# EasyEDA schematic SCH_Senior_Transmitter_2026-03-29.json
TITLE: Sheet_1; REV: 1.0; Date: 2025-12-26; Sheet: 1/1; Company: Your Company
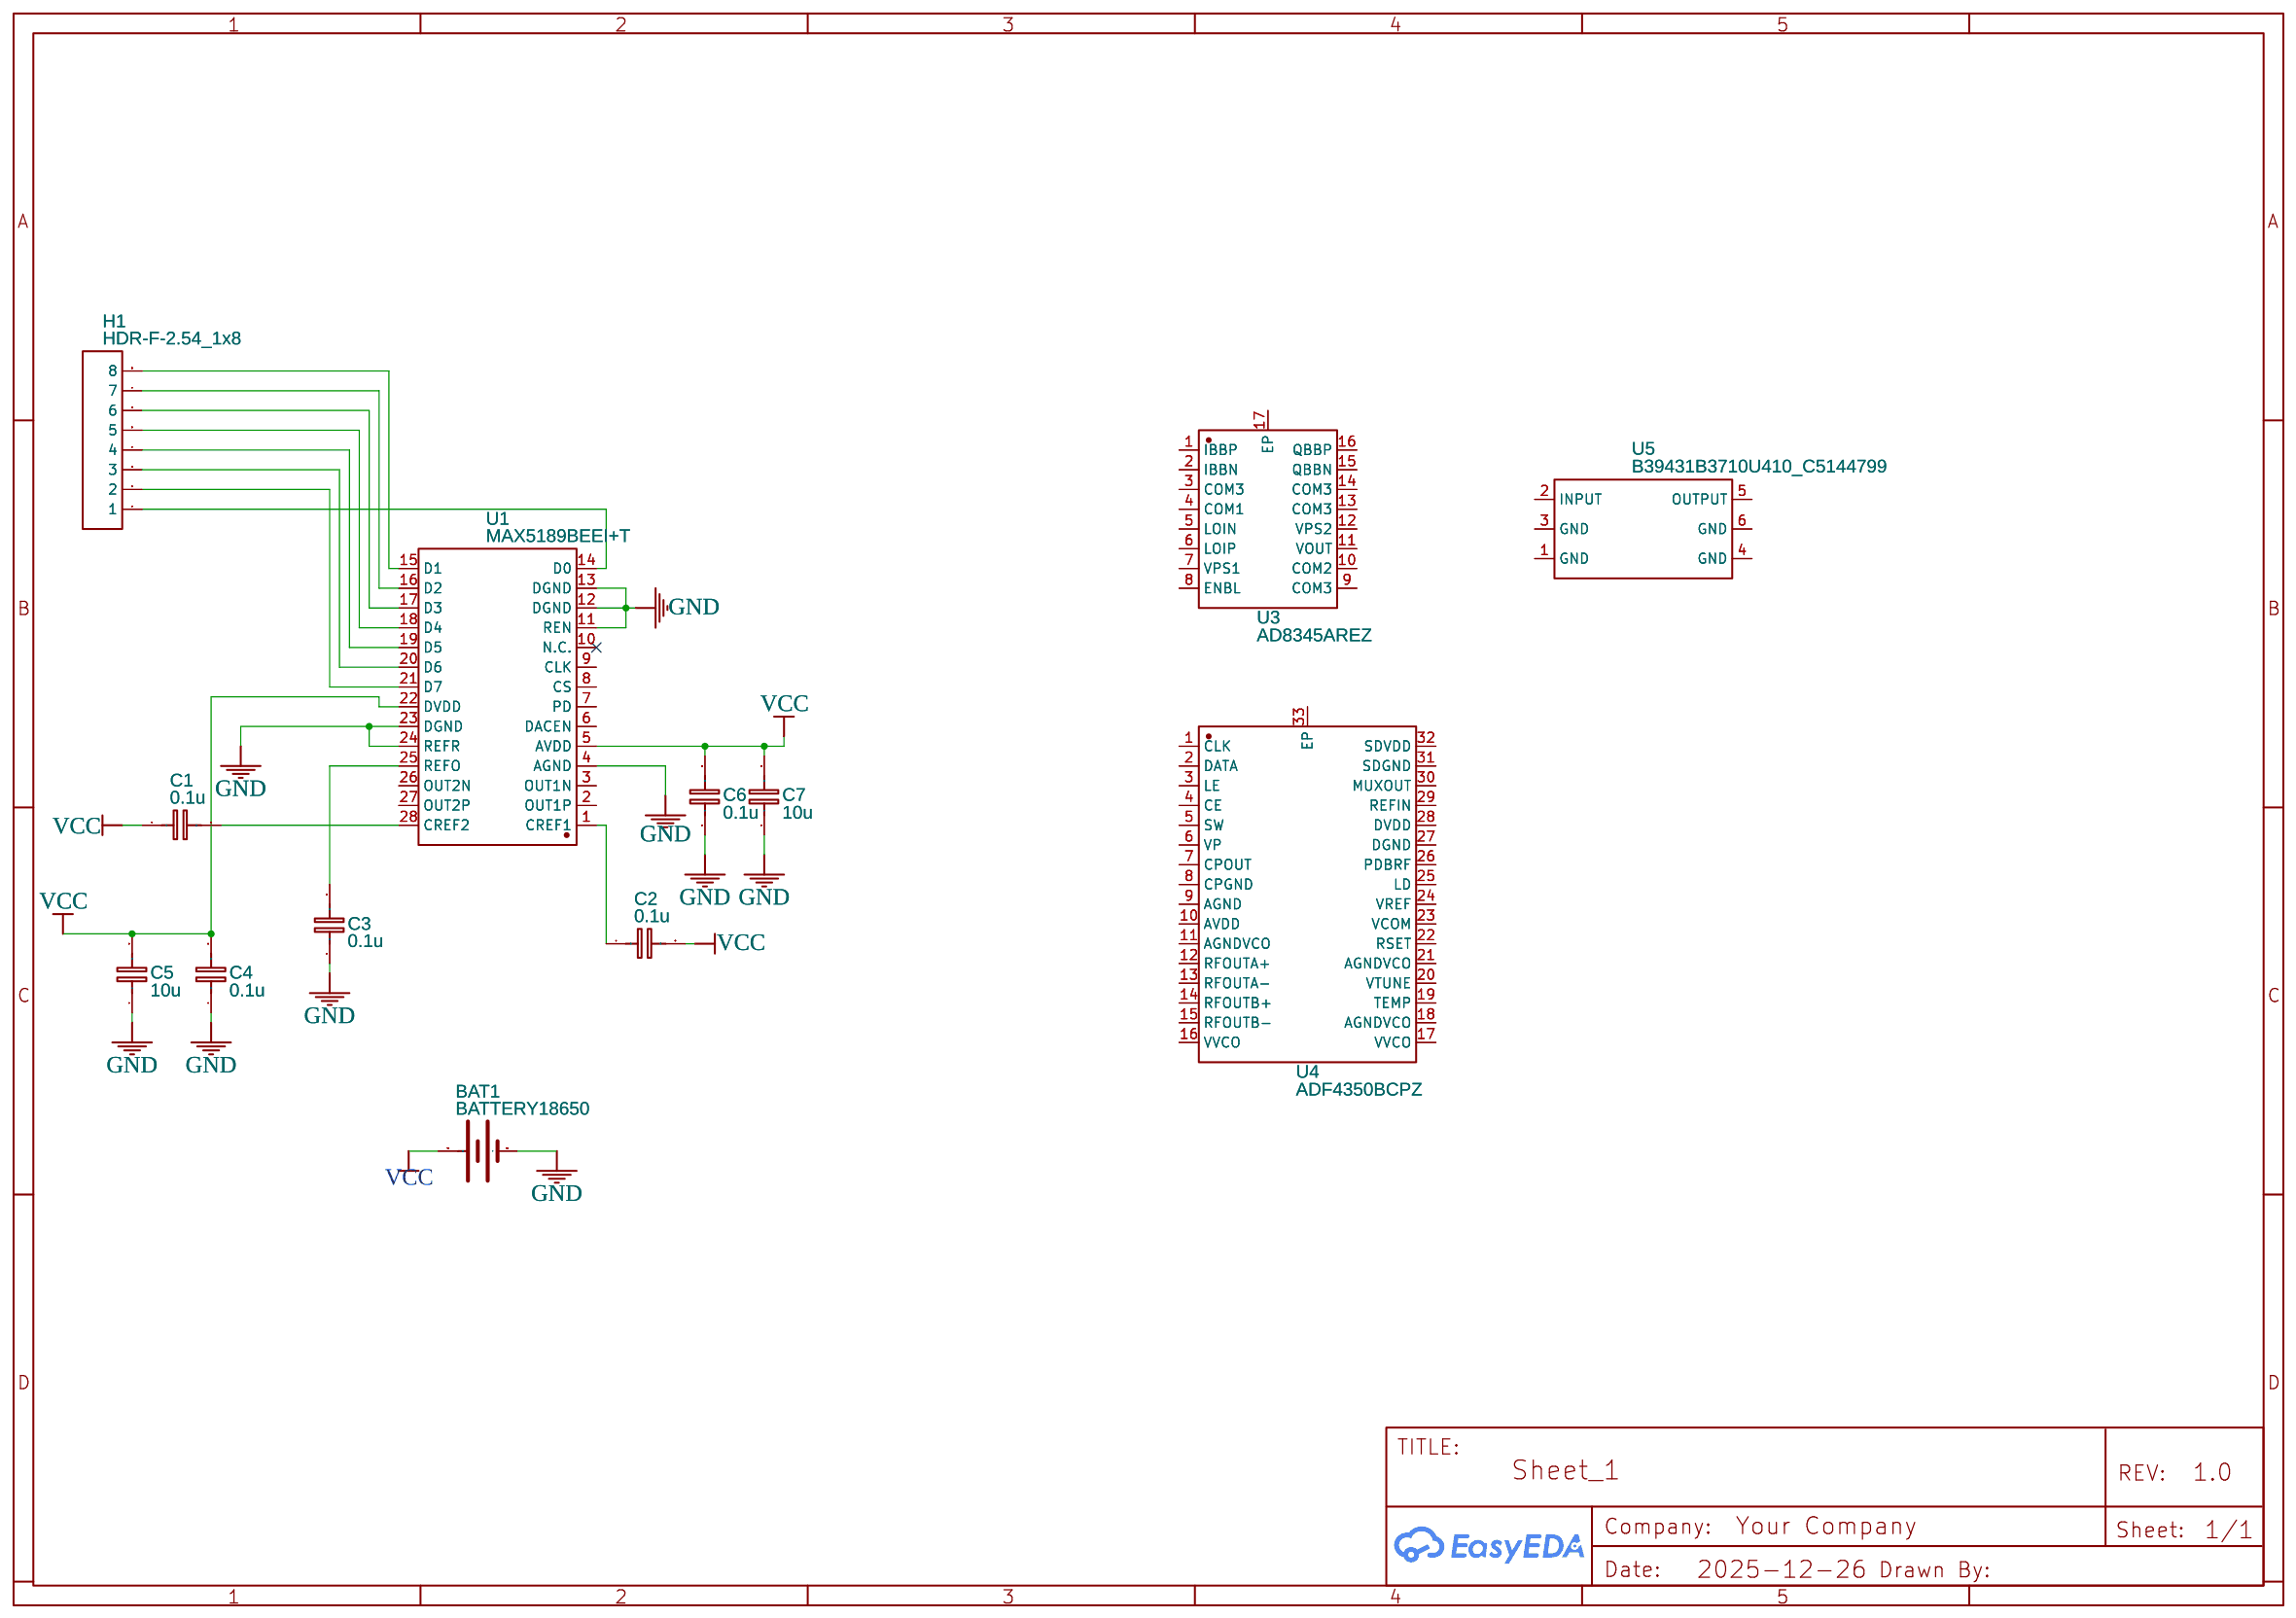
[diagram p0: schematic sheet]

## Parts
BAT1  BATTERY18650  [BATTERY_18650-HOLDER]
C1  0.1u  [C0603]
C2  0.1u  [C0603]
C3  0.1u  [C0603]
C4  0.1u  [C0603]
C5  10u  [C0603]
C6  0.1u  [C0603]
C7  10u  [C0603]
H1  HDR-F-2.54_1x8  [HDR-F-2.54_1X8]
U1  MAX5189BEEI+T  [QSOP-28_L9.8-W3.99-P0.635-LS6.2-TL]
U3  AD8345AREZ  [TSSOP-16_L5.0-W4.4-P0.65-LS6.4-BL-EP2.8]
U4  ADF4350BCPZ  [LFCSP-32_L5.0-W5.0-P0.50-TL-EP3.1]
U5  B39431B3710U410_C5144799  [OSC-SMD_6P-L3.0-W3.0-BL-1]

## Library data of the parts
BAT1 = BATTERY18650: Battery Holders; Contributor: SparkFun
C1-C7 = C_0603_EU: Contributor: LCEDA_Lib
H1 = HDR-F-2.54_1x8: Supplier Part: C225505; Supplier: LCSC; Contributor: LCEDA_Lib
U1 = MAX5189BEEI+T: Contributor: LCSC; Supplier: LCSC; Supplier Part: C2679726; Manufacturer: ADI(亚德诺)/MAXIM(美信); JLCPCB Part Class: Extended Part
U3 = AD8345AREZ: Contributor: LCSC; Supplier: LCSC; Supplier Part: C652725; Manufacturer: ADI(亚德诺)
U4 = ADF4350BCPZ: Contributor: LCSC; Supplier: LCSC; Supplier Part: C578982; Manufacturer: ADI(亚德诺); JLCPCB Part Class: Extended Part
U5 = B39431B3710U410_C5144799: Contributor: lcsc; Supplier: LCSC; Supplier Part: C5144799; Manufacturer: null; Manufacturer Part: B39431B3710U410; JLCPCB Part Class: Extended Part

## Nets
GND: BAT1.GND@1(-) C3.1 C4.1 C5.1 C6.1 C7.1 U1.4(AGND) U1.11(REN) U1.12(DGND) U1.13(DGND) U1.23(DGND) U1.24(REFR)
VCC: BAT1.PWR@1(+) C1.1 C2.2 C4.2 C5.2 C6.2 C7.2 U1.5(AVDD) U1.22(DVDD)
Net-(C1-2): C1.2 U1.28(CREF2)
Net-(C2-1): C2.1 U1.1(CREF1)
Net-(C3-2): C3.2 U1.25(REFO)
Net-(H1-1): H1.1 U1.14(D0)
Net-(H1-2): H1.2 U1.21(D7)
Net-(H1-3): H1.3 U1.20(D6)
Net-(H1-4): H1.4 U1.19(D5)
Net-(H1-5): H1.5 U1.18(D4)
Net-(H1-6): H1.6 U1.17(D3)
Net-(H1-7): H1.7 U1.16(D2)
Net-(H1-8): H1.8 U1.15(D1)

Not connected (* = marked no-connect by the designer): U1 2(OUT1P) 3(OUT1N) 6(DACEN) 7(PD) 8(CS) 9(CLK) 10(N.C.)* 26(OUT2N) 27(OUT2P); U3 1(IBBP) 2(IBBN) 3(COM3) 4(COM1) 5(LOIN) 6(LOIP) 7(VPS1) 8(ENBL) 9(COM3) 10(COM2) 11(VOUT) 12(VPS2) 13(COM3) 14(COM3) 15(QBBN) 16(QBBP) 17(EP); U4 1(CLK) 2(DATA) 3(LE) 4(CE) 5(SW) 6(VP) 7(CPOUT) 8(CPGND) 9(AGND) 10(AVDD) 11(AGNDVCO) 12(RFOUTA+) 13(RFOUTA-) 14(RFOUTB+) 15(RFOUTB-) 16(VVCO) 17(VVCO) 18(AGNDVCO) 19(TEMP) 20(VTUNE) 21(AGNDVCO) 22(RSET) 23(VCOM) 24(VREF) 25(LD) 26(PDBRF) 27(DGND) 28(DVDD) 29(REFIN) 30(MUXOUT) 31(SDGND) 32(SDVDD) 33(EP); U5 1(GND) 2(INPUT) 3(GND) 4(GND) 5(OUTPUT) 6(GND)
